# EAGLE schematic main (EAGLE 7.4.0)
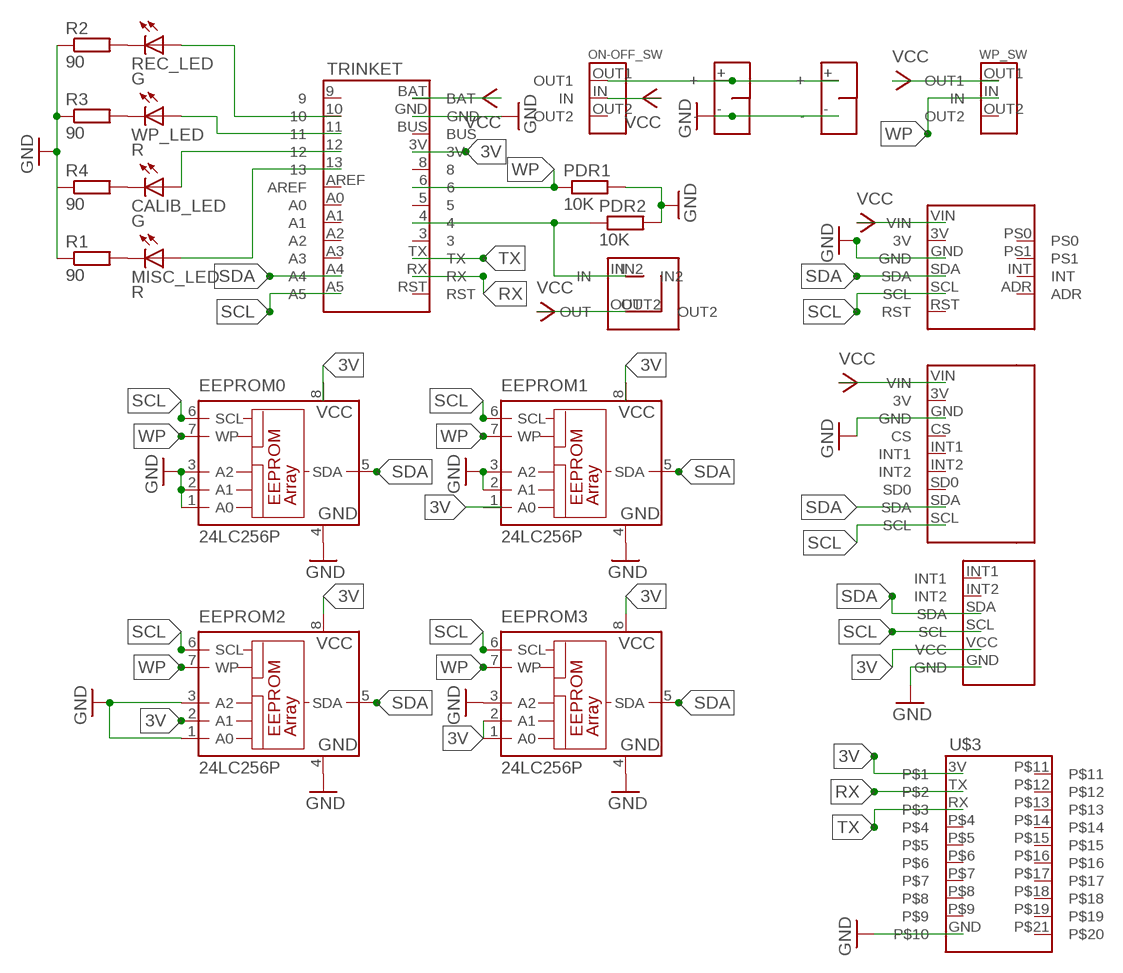
[diagram p0: schematic, sheet 1]

## Parts
9DOF  9DOF  [9DOF]
ACCELEROMETER  ACCELEROMETER  [ACCELEROMETER]
CALIB_LED  G  LED3MM  [LED3MM]
EEPROM0  24LC256P  [DIL8]
EEPROM1  24LC256P  [DIL8]
EEPROM2  24LC256P  [DIL8]
EEPROM3  24LC256P  [DIL8]
MISC_LED  R  LED3MM  [LED3MM]
ON-OFF_SW  SWITCH  [SWITCH]
PDR1  10K  R-EU_0204/7  [0204/7]
PDR2  10K  R-EU_0204/7  [0204/7]
PS1  JST-CON  [JST]
PS2  JST-CON  [JST]
R1  90  R-EU_0204/7  [0204/7]
R2  90  R-EU_0204/7  [0204/7]
R3  90  R-EU_0204/7  [0204/7]
R4  90  R-EU_0204/7  [0204/7]
REC_LED  G  LED3MM  [LED3MM]
TRINKET  TRINKET  [TRINKET]
U$1  PRESSURE  [PRESSURE]
U$2  PUSHBUTTON  [PUSBUTTON]
U$3  XBEE  [XBEE]
WP_LED  R  LED3MM  [LED3MM]
WP_SW  SWITCH  [SWITCH]

## Nets
3V: EEPROM2.2(A1) EEPROM2.8(VCC) EEPROM3.1(A0) EEPROM3.2(A1) EEPROM3.8(VCC) TRINKET.3V U$1.VCC U$3.3V
GND: 9DOF.GND ACCELEROMETER.GND EEPROM0.1(A0) EEPROM0.2(A1) EEPROM0.3(A2) EEPROM0.4(GND) EEPROM1.2(A1) EEPROM1.3(A2) EEPROM1.4(GND) EEPROM2.1(A0) EEPROM2.3(A2) EEPROM2.4(GND) EEPROM3.3(A2) EEPROM3.4(GND) PDR1.2 PDR2.2 PS1.- PS2.- R1.1 R2.1 R3.1 R4.1 TRINKET.GND U$1.GND U$3.GND
N$4: PDR2.1 TRINKET.4 U$2.IN
N$6: TRINKET.11 WP_LED.A
N$7: CALIB_LED.A TRINKET.12
N$8: MISC_LED.A TRINKET.13
N$9: R3.2 WP_LED.K(C)
N$10: CALIB_LED.K(C) R4.2
N$11: MISC_LED.K(C) R1.2
N$13: REC_LED.A TRINKET.10
N$14: R2.2 REC_LED.K(C)
RX: TRINKET.RX U$3.TX
SCL: 9DOF.SCL ACCELEROMETER.SCL EEPROM0.6(SCL) EEPROM1.6(SCL) EEPROM2.6(SCL) EEPROM3.6(SCL) TRINKET.A5 U$1.SCL
SDA: 9DOF.SDA ACCELEROMETER.SDA EEPROM0.5(SDA) EEPROM1.5(SDA) EEPROM2.5(SDA) EEPROM3.5(SDA) TRINKET.A4 U$1.SDA
TX: TRINKET.TX U$3.RX
VCC: 9DOF.VIN ACCELEROMETER.VIN ON-OFF_SW.IN ON-OFF_SW.OUT1 PS1.+ PS2.+ TRINKET.BAT U$2.OUT WP_SW.OUT1
WP: EEPROM0.7(WP) EEPROM1.7(WP) EEPROM2.7(WP) EEPROM3.7(WP) PDR1.1 TRINKET.6 WP_SW.IN
Unconnected: 9DOF.3V 9DOF.ADR 9DOF.INT 9DOF.PS0 9DOF.PS1 9DOF.RST ACCELEROMETER.3V ACCELEROMETER.CS ACCELEROMETER.INT1 ACCELEROMETER.INT2 ACCELEROMETER.SD0 EEPROM1.1(A0) ON-OFF_SW.OUT2 TRINKET.3 TRINKET.5 TRINKET.8 TRINKET.9 TRINKET.A0 TRINKET.A1 TRINKET.A2 TRINKET.A3 TRINKET.AREF TRINKET.BUS TRINKET.RST U$1.INT1 U$1.INT2 U$2.IN2 U$2.OUT2 U$3.P$4 U$3.P$5 U$3.P$6 U$3.P$7 U$3.P$8 U$3.P$9 U$3.P$11 U$3.P$12 U$3.P$13 U$3.P$14 U$3.P$15 U$3.P$16 U$3.P$17 U$3.P$18 U$3.P$19 U$3.P$21 WP_SW.OUT2

## Power pins joined to a net without a drawn wire
VCC: EEPROM0.8(VCC) EEPROM1.8(VCC)

## Library data of the parts
9DOF = myLib:9DOF
ACCELEROMETER = myLib:ACCELEROMETER
CALIB_LED MISC_LED REC_LED WP_LED = led:LED: LED OSRAM: - CHIPLED LG R971, LG N971, LY N971, LG Q971, LY Q971, LO R971, LY R971 LH N974, LH R974 LS Q976, LO Q976, LY Q976 LO Q996 - Hyper CHIPLED LW Q18S LB Q993, LB Q99A, LB R99A - SideLED LS A670, LO A670, LY A670, LG A670, LP A670 LB A673, LV A673, LT A673, LW A673 LH A674 LY A675 LS A676, LA A676, LO A676, LY A676, LW A676 LS A679, LY A679, LG A679 - Hyper Micro SIDELED® LS Y876, LA Y876, LO Y876, LY Y876 LT Y87S - SmartLED LW L88C, LW L88S LB L89C, LB L89S, LG L890 LS L89K, LO L89K, LY L89K LS L896, LA L896, LO L896, LY L896 - TOPLED LS T670, LO T670, LY T670, LG T670, LP T670 LSG T670, LSP T670, LSY T670, LOP T670, LYG T670 LG T671, LOG T671, LSG T671 LB T673, LV T673, LT T673, LW T673 LH T674 LS T676, LA T676, LO T676, LY T676, LB T676, LH T676, LSB T676, LW T676 LB T67C, LV T67C, LT T67C, LS T67K, LO T67K, LY T67K, LW E67C LS E67B, LA E67B, LO E67B, LY E67B, LB E67C, LV E67C, LT E67C LW T67C LS T679, LY T679, LG T679 LS T770, LO T770, LY T770, LG T770, LP T770 LB T773, LV T773, LT T773, LW T773 LH T774 LS E675, LA E675, LY E675, LS T675 LS T776, LA T776, LO T776, LY T776, LB T776 LHGB T686 LT T68C, LB T68C - Hyper Mini TOPLED® LB M676 - Mini TOPLED Santana® LG M470 LS M47K, LO M47K, LY M47K Source: http://www.osram.convergy.de LUXEON: - LUMILED® LXK2-PW12-R00, LXK2-PW12-S00, LXK2-PW14-U00, LXK2-PW14-V00 LXK2-PM12-R00, LXK2-PM12-S00, LXK2-PM14-U00 LXK2-PE12-Q00, LXK2-PE12-R00, LXK2-PE12-S00, LXK2-PE14-T00, LXK2-PE14-U00 LXK2-PB12-K00, LXK2-PB12-L00, LXK2-PB12-M00, LXK2-PB14-N00, LXK2-PB14-P00, LXK2-PB14-Q00 LXK2-PR12-L00, LXK2-PR12-M00, LXK2-PR14-Q00, LXK2-PR14-R00 LXK2-PD12-Q00, LXK2-PD12-R00, LXK2-PD12-S00 LXK2-PH12-R00, LXK2-PH12-S00 LXK2-PL12-P00, LXK2-PL12-Q00, LXK2-PL12-R00 Source: www.luxeon.com KINGBRIGHT: KA-3528ASYC Source: www.kingbright.com
EEPROM0 EEPROM1-EEPROM3 = microchip:24*: Serial EEPROM I2C; MF: MICROCHIP; MPN: 24LC256-E/P; OC_FARNELL: 9757970; OC_NEWARK: 92C7169
ON-OFF_SW WP_SW = myLib:SWITCH
PDR1 PDR2 R1-R4 = resistor:R-EU_: RESISTOR, European symbol
PS1 PS2 = myLib:JST-CON
TRINKET = myLib:TRINKET
U$1 = myLib:PRESSURE
U$2 = myLib:PUSHBUTTON
U$3 = myLib:XBEE